# EAGLE schematic temp_sub_module (EAGLE 7.6.0)
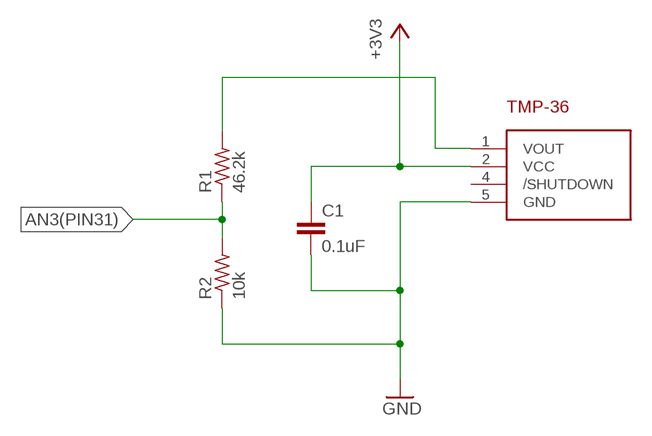
[diagram p0: schematic, sheet 1]

## Parts
C1  0.1uF  C-EU025-024X044  [C025-024X044]
R1  46.2k  R-US_0204/2V  [0204V]
R2  10k  R-US_0204/2V  [0204V]
U$1  TMP36  [SOT-23]

## Nets
+3V3: C1.1 U$1.2(VCC)
AN3(PIN31): R1.1 R2.2
GND: C1.2 R2.1 U$1.5(GND)
N$1: R1.2 U$1.1(VOUT)
Unconnected: U$1.4(/SHUTDOWN)

## Library data of the parts
C1 = rcl:C-EU: CAPACITOR, European symbol
R1 R2 = resistor:R-US_: RESISTOR, American symbol
U$1 = TMP36:TMP36